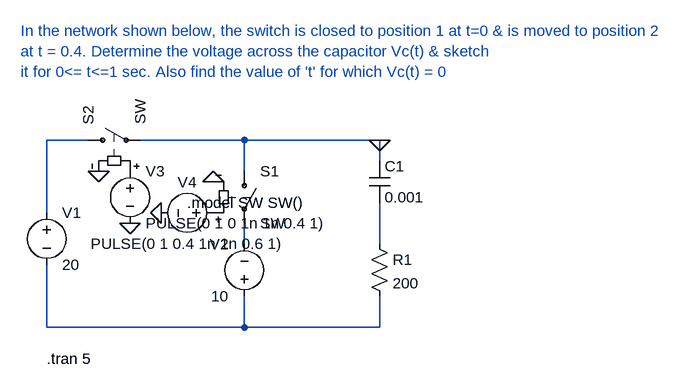
[diagram p0: schematic Lab4_ques2.asc]
Lab4_ques2.asc, the LTspice schematic file:
Version 4
SHEET 1 1012 680
WIRE 96 112 32 112
WIRE 336 112 176 112
WIRE 544 112 336 112
WIRE 544 144 544 112
WIRE 336 160 336 112
WIRE 32 224 32 112
WIRE 336 272 336 240
WIRE 544 272 544 208
WIRE 32 400 32 304
WIRE 336 400 336 352
WIRE 336 400 32 400
WIRE 544 400 544 352
WIRE 544 400 336 400
FLAG 112 160 0
FLAG 288 176 0
FLAG 208 224 0
FLAG 160 240 0
FLAG 544 112 0
SYMBOL Cap 528 144 R0
SYMATTR InstName C1
SYMATTR Value 0.001
SYMBOL Res 528 256 R0
SYMATTR InstName R1
SYMATTR Value 200
SYMBOL Voltage 32 208 R0
SYMATTR InstName V1
SYMATTR Value 20
SYMBOL Voltage 336 368 R180
WINDOW 0 24 96 Left 2
WINDOW 3 24 16 Left 2
SYMATTR InstName V2
SYMATTR Value 10
SYMBOL sw 336 144 R0
SYMATTR InstName S1
SYMBOL sw 80 112 R270
SYMATTR InstName S2
SYMBOL Voltage 160 144 R0
SYMATTR InstName V3
SYMATTR Value PULSE(0 1 0 1n 1n 0.4 1)
SYMBOL Voltage 304 224 R90
WINDOW 0 -32 56 VBottom 2
WINDOW 3 32 56 VTop 2
SYMATTR InstName V4
SYMATTR Value PULSE(0 1 0.4 1n 1n 0.6 1)
TEXT 32 448 Left 2 !.tran 5
TEXT 248 208 Left 2 !.model SW SW()
TEXT -8 -56 Left 2 ;In the network shown below, the switch is closed to position 1 at t=0 & is moved to position 2 \nat t = 0.4. Determine the voltage across the capacitor Vc(t) & sketch\nit for 0<= t<=1 sec. Also find the value of 't' for which Vc(t) = 0

The netlist it stands for:
* Lab4_ques2.asc
C1 0 N003 0.001
R1 N003 N004 200
V1 N001 N004 20
V2 N004 N002 10
S1 0 N002 P001 0 SW
S2 N001 0 P002 0 SW
V3 P002 0 PULSE(0 1 0 1n 1n 0.4 1)
V4 P001 0 PULSE(0 1 0.4 1n 1n 0.6 1)
.tran 5
.model SW SW()
* In the network shown below, the switch is closed to position 1 at t=0 & is moved to position 2
* at t = 0.4. Determine the voltage across the capacitor Vc(t) & sketch
* it for 0<= t<=1 sec. Also find the value of 't' for which Vc(t) = 0
.backanno
.end